# Altium project SuperCap UPS Rasp Pi.PrjPcb
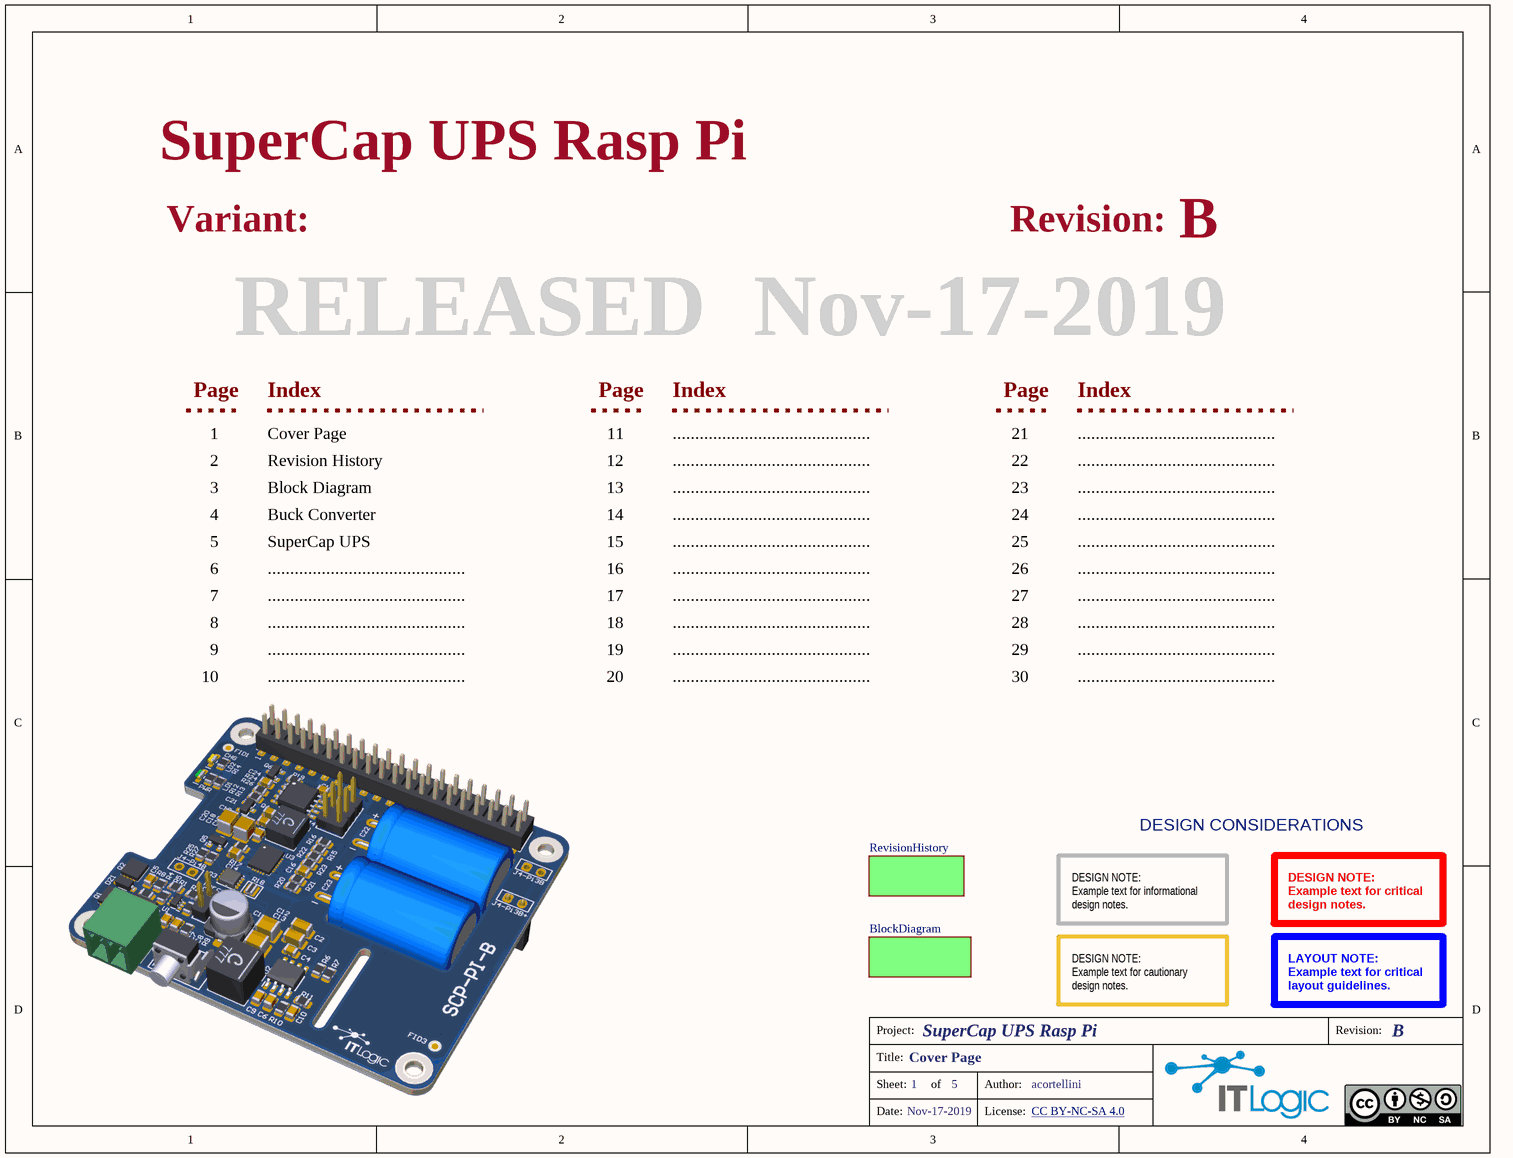
[diagram p0: Cover Page.SchDoc]
VersionRevision: B; ReleaseDate: Nov-17-2019; ProjectTitle: SuperCap UPS Rasp Pi; ProjectCode: SCP-PI-B; ProjectAuthor: acortellini
5 sheets, 79 parts. Net scope: flat (ports and power ports of the same name join across sheets).
Board files: SCAP-PI.PcbDoc, SCAP-PI-2L.PcbDoc, PANEL.PcbDoc
Sheets:
  Cover Page.SchDoc
    RevisionHistory = Revision History.SchDoc
    BlockDiagram = Block Diagram.SchDoc
      Buck Converter & Hat Connector = Buck Converter.SchDoc
      SuperCap UPS = SuperCap UPS.SchDoc

## Sheet Cover Page.SchDoc: Cover Page
size Letter; Organization: IT Logic; Address1: 5753 Highway 85 N; Address2: Crestview, FL 32536; Address3: United States; DocumentNumber: 1; SheetNumber: 1; SheetTotal: 5; Email: pcb-design@itlogic.cloud

### Sub-sheets
BlockDiagram = Block Diagram.SchDoc: no entries
RevisionHistory = Revision History.SchDoc: no entries

### Notes on the sheet
- Variant:
- Revision:
- RELEASED
- Page
- Index
- 1
- 2
- 3
- Cover Page
- Revision History
- Block Diagram
- 11
- 12
- 13
- ............................................
- 21
- 22
- 23
- 4
- 5
- Buck Converter
- SuperCap UPS
- 14
- 15
- 24
- 25
- 6
- 7
- 8
- 16
- 17
- 18
- 26
- 27
- 28
- 9
- 10
- 19
- 20
- 29
- 30
- DESIGN CONSIDERATIONS
- DESIGN NOTE:
  Example text for informational
  design notes.
- DESIGN NOTE:
  Example text for critical
  design notes.
- DESIGN NOTE:
  Example text for cautionary
  design notes.
- LAYOUT NOTE:
  Example text for critical
  layout guidelines.
- Project:
- Title:
- Sheet:
- of
- Author:
- Date:
- License:
- CC BY-NC-SA 4.0 <https://creativecommons.org/licenses/by-nc-sa/4.0/>

## Sheet Revision History.SchDoc: Revision History
size Letter; Author: Alfredo Cortellini; Organization: IT Logic; Address1: 5753 Highway 85 N; Address2: Crestview, FL 32536; Address3: United States; DocumentNumber: 2; SheetNumber: 2; SheetTotal: 5; Email: pcb-design@itlogic.cloud
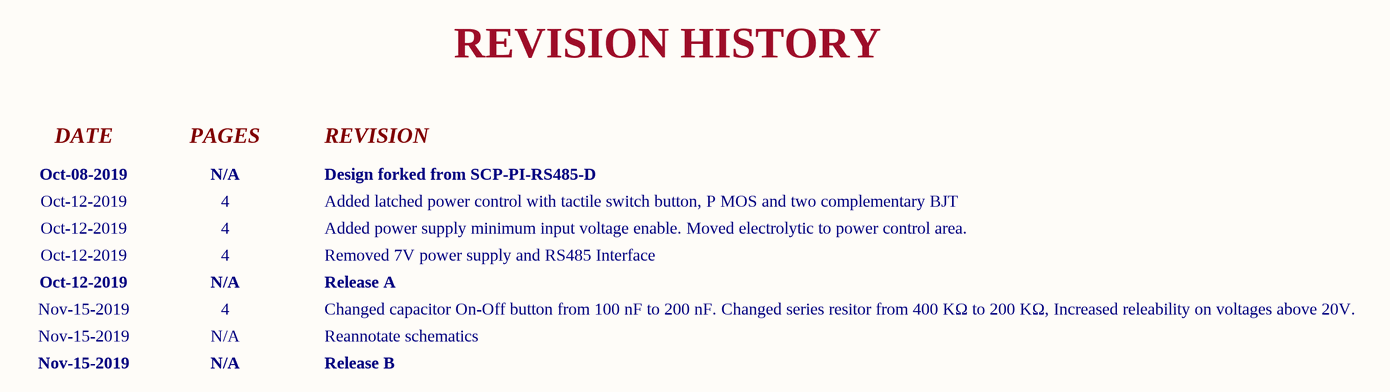
[diagram p1: Revision History.SchDoc]

### Notes on the sheet
- REVISION HISTORY
- DATE
- PAGES
- REVISION
- Oct-08-2019
- Oct-12-2019
- N/A
- 4
- Added latched power control with tactile switch button, P MOS and two complementary BJT
- Design forked from SCP-PI-RS485-D
- Removed 7V power supply and RS485 Interface
- Release A
- Added power supply minimum input voltage enable. Moved electrolytic to power control area.
- Nov-15-2019
- Reannotate schematics
- Changed capacitor On-Off button from 100 nF to 200 nF. Changed series resitor from 400 KΩ to 200 KΩ, Increased releability on voltages above 20V.
- Release B
- Project:
- Revision:
- Title:
- Sheet:
- of
- Author:
- Date:
- License:
- CC BY-NC-SA 4.0 <https://creativecommons.org/licenses/by-nc-sa/4.0/>

## Sheet Block Diagram.SchDoc: Block Diagram
size Letter; Author: Alfredo Cortellini; Organization: IT Logic; Address1: 5753 Highway 85 N; Address2: Crestview, FL 32536; Address3: United States; DocumentNumber: 3; SheetNumber: 3; SheetTotal: 5; Email: pcb-design@itlogic.cloud
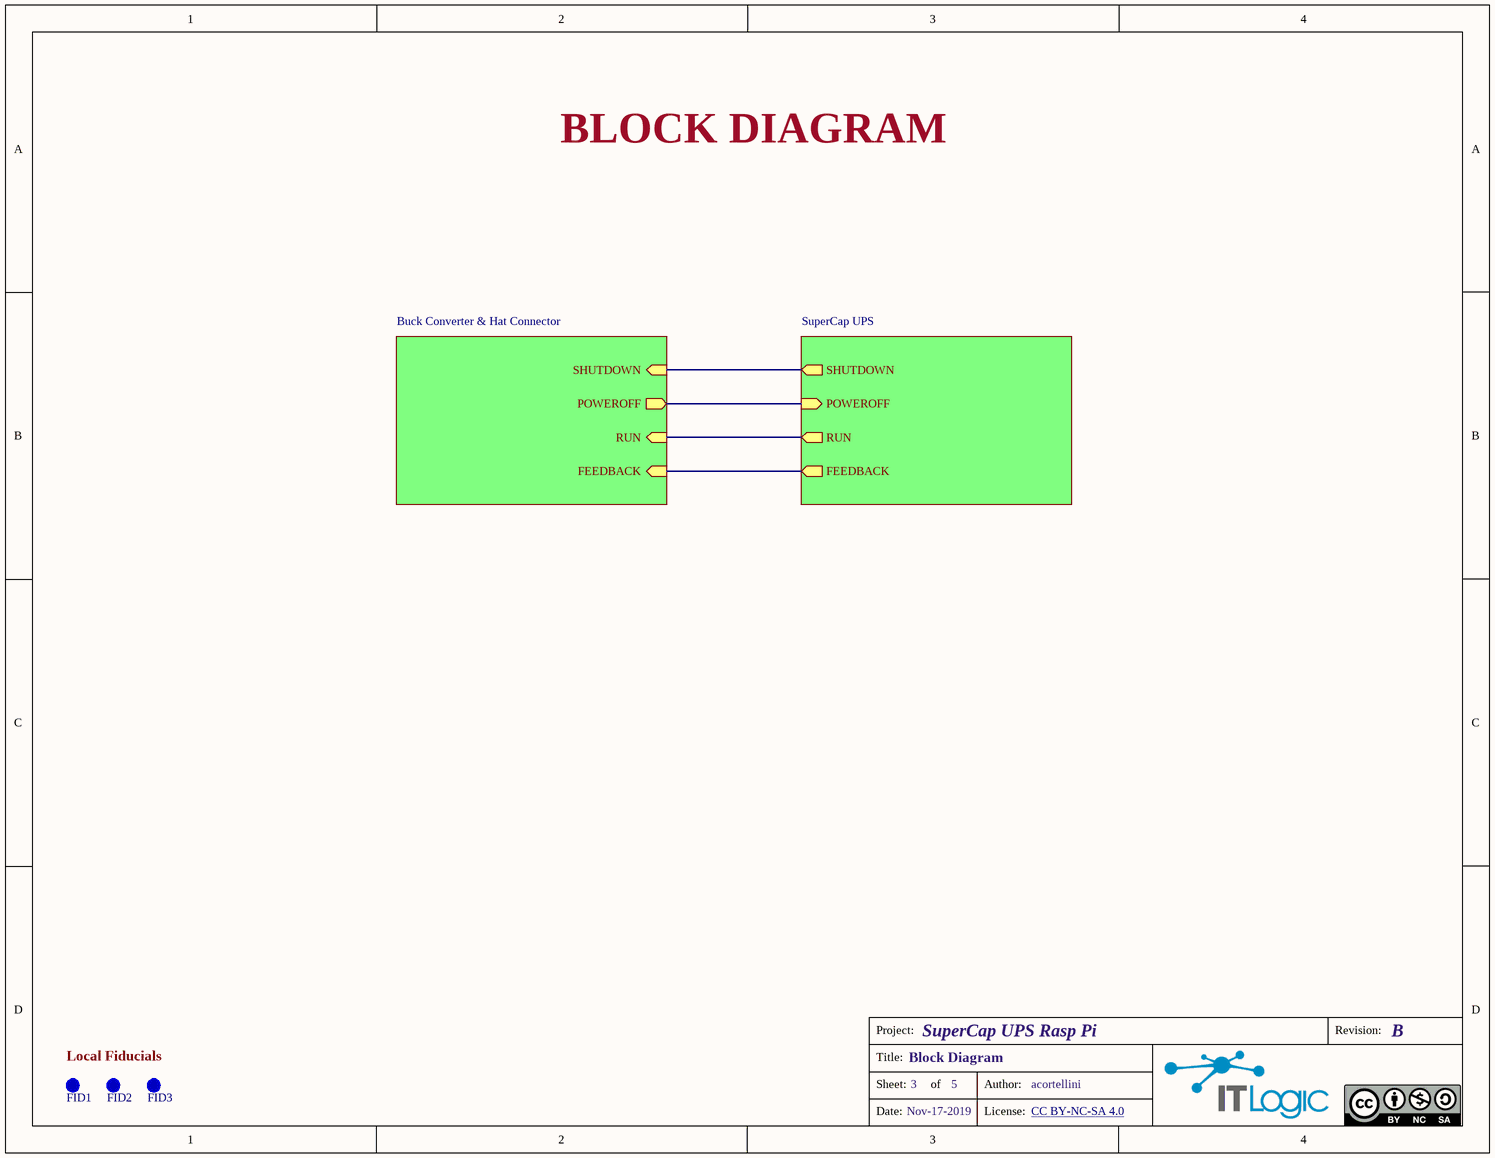
[diagram p2: Block Diagram.SchDoc]

### Parts
FID1  Local Fiducial  [FID-1-2MM]  (value not drawn)
FID2  Local Fiducial  [FID-1-2MM]  (value not drawn)
FID3  Local Fiducial  [FID-1-2MM]  (value not drawn)

### Sub-sheets
Buck Converter & Hat Connector = Buck Converter.SchDoc: POWEROFF (out), SHUTDOWN (in), RUN (in), FEEDBACK (in)
SuperCap UPS = SuperCap UPS.SchDoc: SHUTDOWN (out), POWEROFF (in), RUN (out), FEEDBACK (out)

### Nets
(unnamed): sheet Buck Converter & Hat Connector/POWEROFF, sheet SuperCap UPS/POWEROFF
(unnamed): sheet Buck Converter & Hat Connector/SHUTDOWN, sheet SuperCap UPS/SHUTDOWN
(unnamed): sheet Buck Converter & Hat Connector/RUN, sheet SuperCap UPS/RUN
(unnamed): sheet Buck Converter & Hat Connector/FEEDBACK, sheet SuperCap UPS/FEEDBACK

### Notes on the sheet
- BLOCK DIAGRAM
- Local Fiducials
- Project:
- Revision:
- Title:
- Sheet:
- of
- Author:
- Date:
- License:
- CC BY-NC-SA 4.0 <https://creativecommons.org/licenses/by-nc-sa/4.0/>

### Library data of the parts
FID1-FID3 = FID-1-2MM: Fiducial 1.0mm Diameter, 2.0mmil Mask

## Sheet Buck Converter.SchDoc: Buck Converter
size Letter; Author: Alfredo Cortellini; Organization: IT Logic; Address1: 5753 Highway 85 N; Address2: Crestview, FL 32536; Address3: United States; DocumentNumber: 4; SheetNumber: 4; SheetTotal: 5; Email: pcb-design@itlogic.cloud
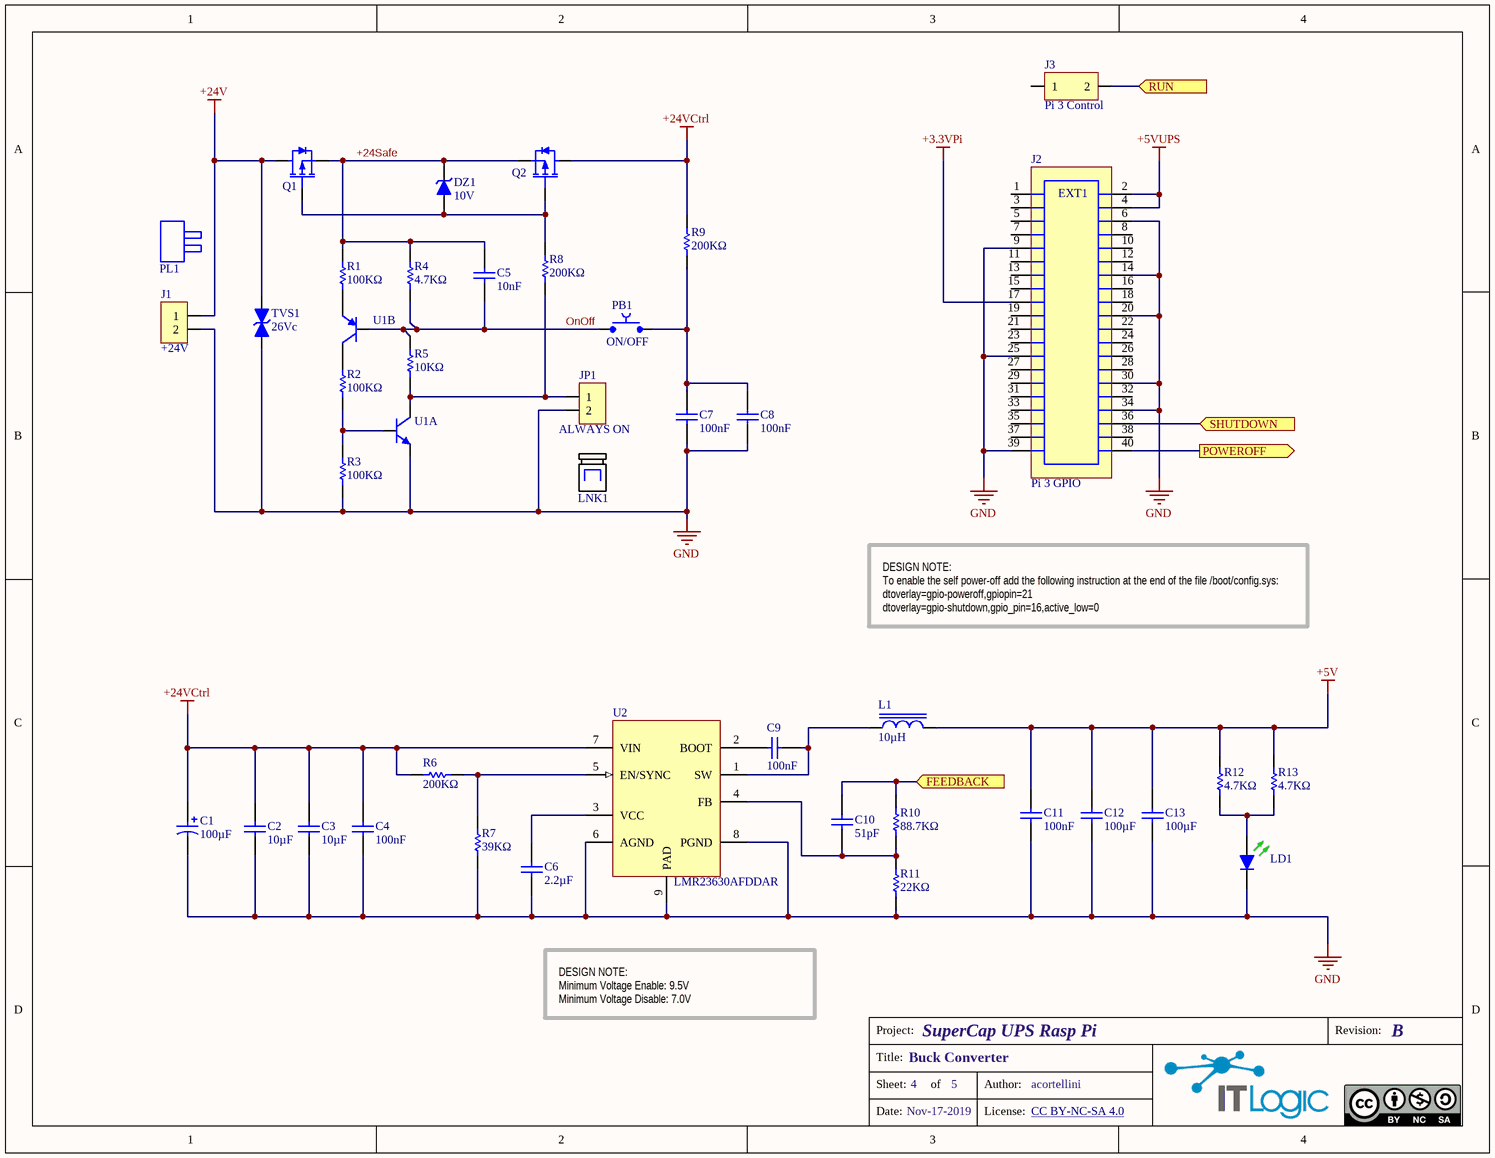
[diagram p3: Buck Converter.SchDoc]

### Parts
C1  100µF  [C-AE-C6-H60]
C2  10µF  [C1206-H180]
C3  10µF  [C1206-H180]
C4  100nF  [C0805-H10]
C5  10nF  [C0805-H10]
C6  2.2µF  [C0805-H140]
C7  100nF  [C0805-H10]
C8  100nF  [C0805-H10]
C9  100nF  [C0805-H10]
C10  51pF  [C0805-H10]
C11  100nF  [C0805-H10]
C12  100µF  [C1210-H250]
C13  100µF  [C1210-H250]
DZ1  10V  [SOD-123]
EXT1  SSQ-120-03-T-D-MEC  [SSQ-120-03-D-BOTTOM]  (value not drawn)
J1  +24V  [691322110002]
J2  Pi 3 GPIO  [HLE-120-02-F-DV-BE]
J3  Pi 3 Control  [SSQ-102-01-S-BOTTOM]
JP1  ALWAYS ON  [HDR-V-1R-02P-5.8L]
L1  10µH  [IND-XAL6060]
LD1  LTST-S220KGKT  [LED-0805-G-SIDE]  (value not drawn)
LNK1  2-881545-2  (value not drawn)  (mechanical)
PB1  ON/OFF  [BUT-1-1825027-4]
PL1  691361100002  (value not drawn)  (mechanical)
Q1  DMP6023LFG  [PowerDI3333-8-S]  (value not drawn)
Q2  DMP6023LFG  [PowerDI3333-8-S]  (value not drawn)
R1  100KΩ  [R0805-H60]
R2  100KΩ  [R0805-H60]
R3  100KΩ  [R0805-H60]
R4  4.7KΩ  [R0805-H60]
R5  10KΩ  [R0805-H60]
R6  200KΩ  [R0805-H60]
R7  39KΩ  [R0805-H60]
R8  200KΩ  [R0805-H60]
R9  200KΩ  [R0805-H60]
R10  88.7KΩ  [R0805-H60]
R11  22KΩ  [R0805-H60]
R12  4.7KΩ  [R0805-H60]
R13  4.7KΩ  [R0805-H60]
TVS1  26Vc  [DO-214AC-SMA-NO POL]
U1  MBT3946DW1T1G  [SOT-363]  (value not drawn)  (parts A,B of 2)
U2  LMR23630AFDDAR  [SOIC-8-N-HT]

### Ports
FEEDBACK (in), POWEROFF (out), RUN (in), SHUTDOWN (in)

### Nets
+3.3VPi: J2.17
+5V: C11.2 C12.2 C13.2 L1.2 R12.2 R13.2
+5VUPS: J2.2 J2.4
+24V: J1.1 Q1.3(D) TVS1.2
+24VCtrl: C1.1 C2.2 C3.2 C4.2 Q2.3(D) R6.2 R9.2 U2.7(VIN)
GND: C1.2 C2.1 C3.1 C4.1 C6.1 C7.1 C8.1 C11.1 C12.1 C13.1 J1.2 J2.6 J2.9 J2.14 J2.20 J2.25 J2.30 J2.34 J2.39 JP1.2 LD1.1(K) R3.1 R7.1 R11.1 TVS1.1 U1.1(E) U2.6(AGND) U2.8(PGND) U2.9(PAD)
+24Safe: C5.2 DZ1.1(K) Q1.1(S) Q2.1(S) R1.1 R4.2
MISO: J2.36 ; port SHUTDOWN
MOSI: J2.40 ; port POWEROFF
OnOff: C5.1 PB1.1 R4.1 R5.1 U1.5(B)
SCK: J3.2 ; port RUN
NetC6_2: C6.2 U2.3(VCC)
NetC7_2: C7.2 C8.2 PB1.2 R9.1
NetC9_1: C9.1 U2.2(BOOT)
NetC9_2: C9.2 L1.1 U2.1(SW)
NetC10_1: C10.1 R10.1 R11.2 U2.4(FB)
NetC10_2: C10.2 R10.2 ; port FEEDBACK
NetDZ1_2: DZ1.2(A) Q1.2(G) Q2.2(G) R8.2
NetJP1_1: JP1.1 R5.2 R8.1 U1.6(C)
NetLD1_2: LD1.2(A) R12.1 R13.1
NetR1_2: R1.2 U1.4(E)
NetR2_1: R2.1 R3.2 U1.2(B)
NetR2_2: R2.2 U1.3(C)
NetR6_1: R6.1 R7.2 U2.5(EN/SYNC)

Not connected (* = marked no-connect by the designer): J2 1 3 5 7 8 10 11 12 13 15 16 18 19 21 22 23 24 26 27 28 29 31 32 33 35 37 38; J3 1

### Notes on the sheet
- DESIGN NOTE:
  To enable the self power-off add the following instruction at the end of the file /boot/config.sys:
  dtoverlay=gpio-poweroff,gpiopin=21
  dtoverlay=gpio-shutdown,gpio_pin=16,active_low=0
- DESIGN NOTE:
  Minimum Voltage Enable: 9.5V
  Minimum Voltage Disable: 7.0V
- Project:
- Revision:
- Title:
- Sheet:
- of
- Author:
- Date:
- License:
- CC BY-NC-SA 4.0 <https://creativecommons.org/licenses/by-nc-sa/4.0/>

### Library data of the parts
C1 = EEE-FT1V101AP: Cap Electrolytic Alu 100uF 300V 20% (5.8 X 6.1mm) SMD 600mA 2000h 105C; Manufacturer: Panasonic; Voltage Rating: 35V; Resistance: 0.26R; Value: 100u; Manufacturer Part Number: EEE-FT1V101AP; Mount: Surface Mount; Capacitance: 100uF; ComponentLink1URL: https://industrial.panasonic.com/cdbs/www-data/pdf/RDE0000/ABA0000C1240.pdf; ComponentLink1Description: Data Sheet; Case: D8
C2 C3 = GRT31CR61H106ME01L: Cap 1206 Case Ceramic 10uF 50V X5S 20%; Manufacturer: Murata; Dielectric: X5R; Value: 10u; Manufacturer Part Number: GRT31CR61H106ME01L; Mount: Surface Mount; Case: 1206; Capacitance: 10uF; Voltage Rating: 50V; ComponentLink1URL: https://www.mouser.com/datasheet/2/400/lcc_commercial_general_en-837201.pdf; ComponentLink1Description: Data Sheet
C4 C7-C9 C11 = C0805C104K5RACTU: Cap 0805 Case Ceramic 100nF 50V X7R; Manufacturer: KEMET; Value: 100n; Manufacturer Part Number: C0805C104K5RACTU; Mount: Surface Mount; Case: 0805; Capacitance: 100nF; Dielectric: X7R; Voltage Rating: 50V; ComponentLink1URL: https://datasheet.ciiva.com/14589/70095383-14589048.pdf; ComponentLink1Description: Data Sheet
C5 = C0805C103K5RACTU: Cap 0805 Case Ceramic 10nF 50V X7R; Manufacturer: KEMET; Value: 10n; Manufacturer Part Number: C0805C103K5RACTU; Mount: Surface Mount; Case: 0805; Dielectric: X7R; Capacitance: 10nF; Voltage Rating: 50V; ComponentLink1URL: https://datasheet.ciiva.com/5904/kem-c1002-x7r-smd-5904709.pdf; ComponentLink1Description: Data Sheet
C6 = C0805C225K4RACTU: Cap 0805 Case Ceramic 2.2uF 16V X7R 10%; Manufacturer: KEMET; Capacitance: 22uF; Value: 2.2u; Manufacturer Part Number: C0805C225K4RACTU; Mount: Surface Mount; Case: 0805; Dielectric: X7R; Voltage Rating: 16V; ComponentLink1URL: http://components.arrow.com/part/dataview/0323_07281823; ComponentLink1Description: Data Sheet
C10 = C0805C510K5GACTU: Cap 0805 Case Ceramic 51pF 50V C0G 10%; Manufacturer: KEMET; Value: 51p; Manufacturer Part Number: C0805C510K5GACTU; Mount: Surface Mount; Case: 0805; Capacitance: 51pF; Dielectric: C0G; Voltage Rating: 50V; ComponentLink1URL: https://www.mouser.com/datasheet/2/212/KEM_C1003_C0G_SMD-1101588.pdf; ComponentLink1Description: Data Sheet
C12 C13 = GRM32ER61A107ME20L: Cap 1210 Case Ceramic 100uF 10V X5S 20%; Manufacturer: Murata; Dielectric: X5R; Value: 100u; Manufacturer Part Number: GRM32ER61A107ME20L; Mount: Surface Mount; Case: 1210; Capacitance: 100uF; Voltage Rating: 10V; ComponentLink1URL: https://www.mouser.com/datasheet/2/400/lcc_commercial_general_en-837201.pdf; ComponentLink1Description: Data Sheet
DZ1 = BZT52C10-E3-08: Diode Zener Single 10V 5% 400mW SOD-123; Manufacturer: Vishay Semiconductors; Manufacturer Part Number: BZT52C10-E3-08; Mount: Surface Mount; Case: SOD-123; Voltage Rating: 10V; ComponentLink1Description: Data Sheet; ComponentLink1URL: https://www.vishay.com/docs/85760/bzt52.pdf
EXT1 = SSQ-120-03-T-D-MEC: Conn Post Socket Header Vert - 2 Row - 20 Pos - 10 mm Lenght - Tin; Manufacturer: Samtec; Current Rating: 3A; Manufacturer Part Number: SSQ-120-03-T-D; Mount: Free Hanging; ComponentLink1URL: https://datasheet.ciiva.com/717/eng-cd-146256-g-146256-c-dwg-717712.pdf; ComponentLink1Description: Data Sheet
J1 = 691322110002: Conn Term Block Header 2 Pos 3.5 mm; Manufacturer: Wurth Electronics; Current Rating: 10A; Voltage Rating: 300V; Manufacturer Part Number: 691322110002; Mount: Through Hole; ComponentLink1URL: https://datasheet.ciiva.com/8043/1442234-8043560.pdf; ComponentLink1Description: Data Sheet
J2 = HLE-120-02-F-DV-BE: Conn Socket Header Vert - 2 Row - 20 Pos - SMD; Manufacturer: Samtec; Current Rating: 3A; Manufacturer Part Number: HLE-120-02-F-DV-BE; Mount: Surface Mount; ComponentLink1URL: https://datasheet.ciiva.com/717/eng-cd-146256-g-146256-c-dwg-717712.pdf; ComponentLink1Description: Data Sheet
J3 = SSQ-102-01-T-S: Conn Post Socket Header Vert - 1 Row - 2 Pos - 3 mm Lenght - Tin; Manufacturer: Samtec; Current Rating: 3A; Manufacturer Part Number: SSQ-102-01-T-S; Mount: Through Hole; ComponentLink1URL: https://datasheet.ciiva.com/717/eng-cd-146256-g-146256-c-dwg-717712.pdf; ComponentLink1Description: Data Sheet
JP1 = 22-28-4023: Breakaway Header Vert - 1 Row - 2 Pos - 6 mm Lenght - Gold; Manufacturer: Molex; Voltage Rating: 250V; Current Rating: 4A; Manufacturer Part Number: 22-28-4023; Mount: Through Hole; ComponentLink1URL: https://datasheet.ciiva.com/10088/0022284023-pcb-headers-10088337.pdf; ComponentLink1Description: Data Sheet
L1 = XAL6060-103MEB: Inductor Power XAL60 Series, 10uH, 7.6A,  Shielded, 27 mOhm, SMD; Manufacturer: Coilcraft; Value: 10u; Manufacturer Part Number: XAL6060-103MEB; Inductance: 10µH; ComponentLink1URL: https://www.coilcraft.com/xal50xx.cfm; ComponentLink1Description: Data Sheet; Mount: Surface Mount
LD1 = LTST-S220KGKT: LED 0805 Side Green 569nm 2-Pin; Manufacturer: Vishay Lite-On; Manufacturer Part Number: LTST-S220KGKT; Mount: Surface Mount; Case: 0805; ComponentLink1URL: https://www.tme.eu/Document/34ab2c4b8c99e859d5012ee3f8356040/LTST-S220GKT.pdf; ComponentLink1Description: Data Sheet
LNK1 = 2-881545-2: Jumper Red, 2 Pos, 2.54 pitch; Manufacturer: TE Connectivity; Manufacturer Part Number: 2-881545-2; ComponentLink1URL: https://datasheet.ciiva.com/3120/c-881545-k-3120181.pdf; ComponentLink1Description: Data Sheet; Mount: Free Hanging
PB1 = 1-1825027-4: Tactile Switch, Round Stem, Color ivory, Lenght 3.55mm, Right Angle, Through Hole.; Manufacturer: TE Connectivity; Voltage Rating: 24V; Current Rating: 50 mA; Manufacturer Part Number: 1-1825027-4; Mount: Through Hole; ComponentLink1URL: https://www.mouser.com/datasheet/2/418/NG_CD_1825027_G4-659945.pdf; ComponentLink1Description: Data Sheet
PL1 = 691361100002: Conn Term Block Plug Vert 2 Pos 3.5 mm; Manufacturer: Wurth Electronics; Current Rating: 10A; Voltage Rating: 300V; Manufacturer Part Number: 691361100002; Mount: Free Hanging; ComponentLink1URL: https://datasheet.ciiva.com/7992/1442235-7992395.pdf; ComponentLink1Description: Data Sheet
Q1 Q2 = DMP6023LFG: Mosfet P 60V Vds 20V Vgs 25mOhm PowerDI3333-8; Manufacturer: Diodes Incorporated; Manufacturer Part Number: DMP6023LFG; Mount: Surface Mount; Case: PowerDI3333-8; ComponentLink1Description: Data Sheet; ComponentLink1URL: https://www.diodes.com/assets/Datasheets/DMP6023LFG.pdf
R1-R3 = RC0805FR-07100KL: Resistor 0805 Case 100KR 1% 1/8W; Manufacturer: Yageo; Voltage Rating: 150V; Value: 100K; Manufacturer Part Number: RC0805FR-07100KL; Case: 0805; Resistance: 100kR; ComponentLink1URL: https://datasheet.ciiva.com/2457/pyu-r-int-thick-7-2457017.pdf; ComponentLink1Description: Data Sheet; Mount: Surface Mount
R4 R12 R13 = RC0805FR-074K7L: Resistor 0805 Case 4.7KR 1% 1/8W; Manufacturer: Yageo; Voltage Rating: 150V; Value: 4.7K; Manufacturer Part Number: RC0805FR-074K7L; Case: 0805; Resistance: 4.7kR; ComponentLink1URL: https://datasheet.ciiva.com/11808/0900766b8106beab-11808155.pdf; ComponentLink1Description: Data Sheet; Mount: Surface Mount
R5 = RC0805FR-0710KL: Resistor 0805 Case 10KR 1% 1/8W; Manufacturer: Yageo; Voltage Rating: 150V; Value: 10K; Manufacturer Part Number: RC0805FR-0710KL; Case: 0805; Resistance: 10kR; ComponentLink1URL: https://datasheet.ciiva.com/11808/0900766b8106beab-11808151.pdf; ComponentLink1Description: Data Sheet; Mount: Surface Mount
R6 R8 R9 = RC0805FR-07200KL: Resistor 0805 Case 200KR 1% 1/8W; Manufacturer: Yageo; Voltage Rating: 150V; Value: 200K; Manufacturer Part Number: RC0805FR-07200KL; Case: 0805; Resistance: 200kR; ComponentLink1URL: https://datasheet.ciiva.com/2457/pyu-r-int-thick-7-2457017.pdf; ComponentLink1Description: Data Sheet; Mount: Surface Mount
R7 = RC0805FR-0739KL: Resistor 0805 Case 39KR 1% 1/8W; Manufacturer: Yageo; Voltage Rating: 150V; Value: 39K; Manufacturer Part Number: RC0805FR-0739KL; Case: 0805; Resistance: 39KR; ComponentLink1URL: https://datasheet.ciiva.com/11808/0900766b8106beab-11808155.pdf; ComponentLink1Description: Data Sheet; Mount: Surface Mount
R10 = RC0805FR-0788K7L: Resistor 0805 Case 88.7KR 1% 1/8W; Manufacturer: Yageo; Voltage Rating: 150V; Value: 88.7K; Manufacturer Part Number: RC0805FR-0788K7L; Case: 0805; Resistance: 88.7kR; ComponentLink1URL: https://datasheet.ciiva.com/2457/pyu-r-int-thick-7-2457521.pdf; ComponentLink1Description: Data Sheet; Mount: Surface Mount
R11 = RC0805FR-0722KL: Resistor 0805 Case 22KR 1% 1/8W; Manufacturer: Yageo; Voltage Rating: 150V; Value: 22K; Manufacturer Part Number: RC0805FR-0722KL; Case: 0805; Resistance: 22kR; ComponentLink1URL: https://datasheet.ciiva.com/2457/pyu-r-int-thick-7-2457521.pdf; ComponentLink1Description: Data Sheet; Mount: Surface Mount
TVS1 = SMAJ26CA: TVS Diode Bidirectional 26Vs, 42.1Vc, 9.5 Amp, SMA; Manufacturer: Littelfuse; Manufacturer Part Number: SMAJ26CA; Mount: Surface Mount; ComponentLink1URL: https://datasheet.ciiva.com/332/littelfuse-tvs-diode-smdj-datasheet-pdf-332997.pdf; ComponentLink1Description: Data Sheet; Case: SMA
U1 = MBT3946DW1T1G: Transistor Complementary Dual 40V  200mA SOT−363; Manufacturer: ON Semiconductor; Manufacturer Part Number: MBT3946DW1T1G; Mount: Surface Mount; Case: SDIP-6; ComponentLink1URL: https://datasheet.ciiva.com/1249/683405-1249888.pdf; ComponentLink1Description: Data Sheet
U2 = LMR23630AFDDAR: Conv DC-DC Sync Step-Down 36V 3A 9-Pin(8+Pab) HSOIC-8; Manufacturer: Texas Instruments; Manufacturer Part Number: LMR23630AFDDAR; Mount: Surface Mount; Case: HSOIC-8; ComponentLink1URL: http://www.ti.com/lit/ds/symlink/lmr23630.pdf; ComponentLink1Description: Data Sheet

## Sheet SuperCap UPS.SchDoc: SuperCap UPS
size Letter; Author: Alfredo Cortellini; Organization: IT Logic; Address1: 5753 Highway 85 N; Address2: Crestview, FL 32536; Address3: United States; DocumentNumber: 5; SheetNumber: 5; SheetTotal: 5; Email: pcb-design@itlogic.cloud
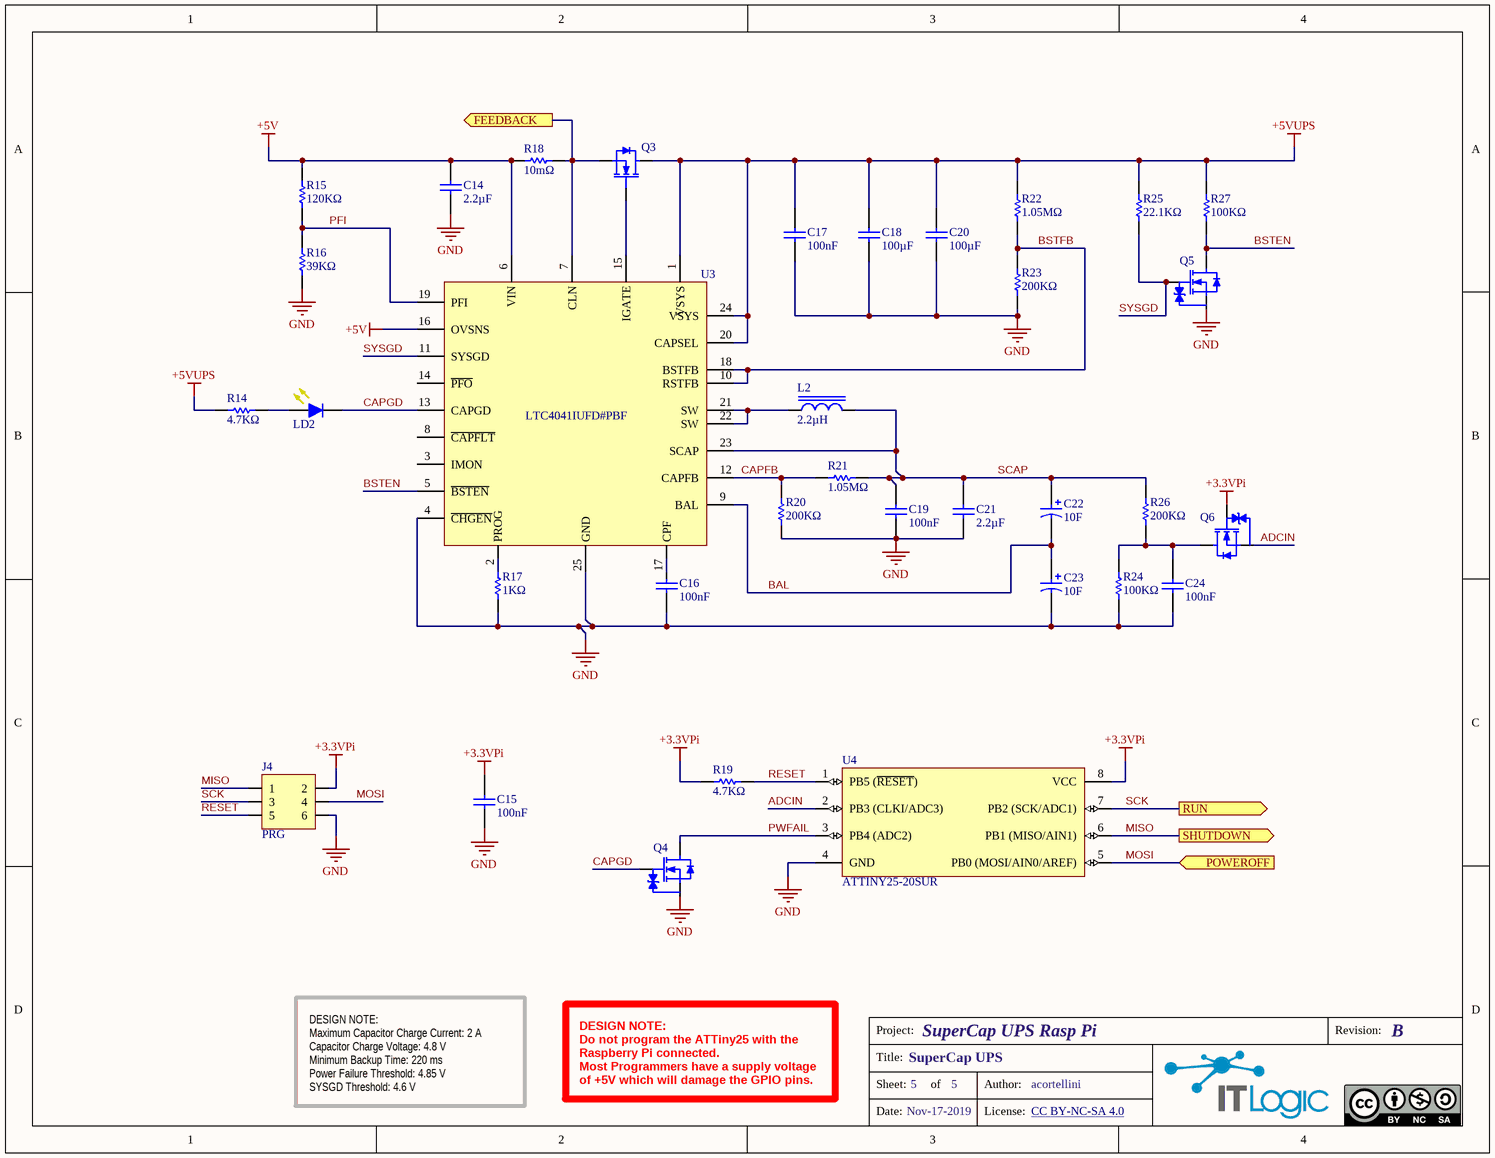
[diagram p4: SuperCap UPS.SchDoc]

### Parts
C14  2.2µF  [C0805-H140]
C15  100nF  [C0805-H10]
C16  100nF  [C0805-H10]
C17  100nF  [C0805-H10]
C18  100µF  [C1210-H250]
C19  100nF  [C0805-H10]
C20  100µF  [C1210-H250]
C21  2.2µF  [C0805-H140]
C22  10F  [C-SCCT20B106PRB-ORIZ]
C23  10F  [C-SCCT20B106PRB-ORIZ]
C24  100nF  [C0805-H10]
J4  PRG  [HDR-V-2R-03P-5.8L]
L2  2.2µH  [IND-XAL5030]
LD2  LTST-S220KSKT  [LED-0805-Y-SIDE]  (value not drawn)
Q3  SISA88DN-T1-GE3  [POWERPAK-1212-8-S]  (value not drawn)
Q4  BSS138K-13  [SOT-23]  (value not drawn)
Q5  BSS138K-13  [SOT-23]  (value not drawn)
Q6  BSS138K-13  [SOT-23]  (value not drawn)
R14  4.7KΩ  [R0805-H60]
R15  120KΩ  [R0805-H60]
R16  39KΩ  [R0805-H60]
R17  1KΩ  [R0805-H60]
R18  10mΩ  [R0508-H60]
R19  4.7KΩ  [R0805-H60]
R20  200KΩ  [R0805-H60]
R21  1.05MΩ  [R0805-H60]
R22  1.05MΩ  [R0805-H60]
R23  200KΩ  [R0805-H60]
R24  100KΩ  [R0805-H60]
R25  22.1KΩ  [R0805-H60]
R26  200KΩ  [R0805-H60]
R27  100KΩ  [R0805-H60]
U3  LTC4041IUFD#PBF  [QFN-50x40-24-THP]
U4  ATTINY25-20SUR  [SOIC-8-W]

### Ports
FEEDBACK (out), POWEROFF (in), RUN (out), SHUTDOWN (out)

### Nets
+3.3VPi: C15.2 J4.2 Q6.1(G) R19.1 U4.8(VCC)
+5V: C14.2 R15.2 R18.1 U3.6(VIN) U3.16(OVSNS)
+5VUPS: C17.2 C18.2 C20.2 Q3.3(D) R14.1 R22.2 R25.2 R27.2 U3.1(VSYS) U3.20(CAPSEL) U3.24(VSYS)
GND: C14.1 C15.1 C16.1 C17.1 C18.1 C19.1 C20.1 C21.1 C23.2 C24.1 J4.6 Q4.2(S) Q5.2(S) R16.1 R17.1 R20.1 R23.1 R24.1 U3.4(~{CHGEN}) U3.25(GND) U4.4(GND)
ADCIN: Q6.2(S) U4.2(PB3_(CLKI/ADC3))
BAL: C22.2 C23.1 U3.9(BAL)
BSTEN: Q5.3(D) R27.1 U3.5(~{BSTEN})
BSTFB: R22.1 R23.2 U3.10(RSTFB) U3.18(BSTFB)
CAPFB: R20.2 R21.1 U3.12(CAPFB)
CAPGD: LD2.1(K) Q4.1(G) U3.13(CAPGD)
MISO: J4.1 U4.6(PB1_(MISO/AIN1)) ; port SHUTDOWN
MOSI: J4.4 U4.5(PB0_(MOSI/AIN0/AREF)) ; port POWEROFF
PFI: R15.1 R16.2 U3.19(PFI)
PWFAIL: Q4.3(D) U4.3(PB4_(ADC2))
RESET: J4.5 R19.2 U4.1(PB5_(~{RESET}))
SCAP: C19.2 C21.2 C22.1 L2.2 R21.2 R26.2 U3.23(SCAP)
SCK: J4.3 U4.7(PB2_(SCK/ADC1)) ; port RUN
SYSGD: Q5.1(G) R25.1 U3.11(SYSGD)
NetC10_2: Q3.1(S) R18.2 U3.7(CLN) ; port FEEDBACK
NetC16_2: C16.2 U3.17(CPF)
NetC24_2: C24.2 Q6.3(D) R24.2 R26.1
NetL2_1: L2.1 U3.21(SW) U3.22(SW)
NetLD2_2: LD2.2(A) R14.2
NetQ3_2: Q3.2(G) U3.15(IGATE)
NetR17_2: R17.2 U3.2(PROG)

Not connected (* = marked no-connect by the designer): U3 3(IMON) 8(~{CAPFLT}) 14(~{PFO})

### Notes on the sheet
- DESIGN NOTE:
  Maximum Capacitor Charge Current: 2 A
  Capacitor Charge Voltage: 4.8 V
  Minimum Backup Time: 220 ms
  Power Failure Threshold: 4.85 V
  SYSGD Threshold: 4.6 V
- DESIGN NOTE:
  Do not program the ATTiny25 with the Raspberry Pi connected.
  Most Programmers have a supply voltage of +5V which will damage the GPIO pins.
- Project:
- Revision:
- Title:
- Sheet:
- of
- Author:
- Date:
- License:
- CC BY-NC-SA 4.0 <https://creativecommons.org/licenses/by-nc-sa/4.0/>

### Library data of the parts
C14 C21 = C0805C225K4RACTU: as C6 on sheet Buck Converter; Manufacturer Part Number: C0805C225K4RACTU; Mount: Surface Mount; Case: 0805; Dielectric: X7R; Voltage Rating: 16V; ComponentLink1URL: http://components.arrow.com/part/dataview/0323_07281823; ComponentLink1Description: Data Sheet
C15-C17 C19 C24 = C0805C104K5RACTU: as C4 on sheet Buck Converter; Manufacturer Part Number: C0805C104K5RACTU; Mount: Surface Mount; Case: 0805; Capacitance: 100nF; Dielectric: X7R; Voltage Rating: 50V; ComponentLink1URL: https://datasheet.ciiva.com/14589/70095383-14589048.pdf; ComponentLink1Description: Data Sheet
C18 C20 = GRM32ER61A107ME20L: as C12 on sheet Buck Converter; Manufacturer Part Number: GRM32ER61A107ME20L; Mount: Surface Mount; Case: 1210; Capacitance: 100uF; Voltage Rating: 10V; ComponentLink1URL: https://www.mouser.com/datasheet/2/400/lcc_commercial_general_en-837201.pdf; ComponentLink1Description: Data Sheet
C22 C23 = SCCT20E106SRB: Cap Super 10F 3.0V (20 X 12.5mm) ESR 50mOhm; Manufacturer: AVX; Resistance: 0.05R; Value: 10; Manufacturer Part Number: SCCT20E106SRB; Mount: Through Hole; Capacitance: 10F; Voltage Rating: 3.0V; ComponentLink1URL: https://datasheet.ciiva.com/3773/41677623s8437994n1386-3773397.pdf; ComponentLink1Description: Data Sheet
J4 = 5-146256-3: Breakaway Header Vert - 2 Row - 3 Pos - 6 mm Lenght - Gold; Manufacturer: TE Connectivity; Current Rating: 3A; Manufacturer Part Number: 5-146256-3; Mount: Through Hole; ComponentLink1URL: https://datasheet.ciiva.com/16290/eng-cd-146256-f2-16290485.pdf; ComponentLink1Description: Data Sheet
L2 = XAL5030-222MEB: Inductor Power SRP6540 Series, 2.2uH, 9.7A,  Shielded, 0.0132 ohm, SMD; Manufacturer: Coilcraft; Value: 2.2u; Manufacturer Part Number: XAL5030-222MEB; Inductance: 2.2uH; ComponentLink1URL: https://www.coilcraft.com/xal50xx.cfm; ComponentLink1Description: Data Sheet; Mount: Surface Mount
LD2 = LTST-S220KSKT: LED 0805 Side Yellow 588nm 2-Pin; Manufacturer: Vishay Lite-On; Manufacturer Part Number: LTST-S220KSKT; Mount: Surface Mount; Case: 0805; ComponentLink1URL: https://www.mouser.com/datasheet/2/239/Lite-On-LTST-S220KSKT-1175446.pdf; ComponentLink1Description: Data Sheet
Q3 = SISA88DN-T1-GE3: Mosfet 30V Vds 20V Vgs 5.4mOhm PowerPAK 1212-8; Manufacturer: Vishay; Manufacturer Part Number: SISA88DN-T1-GE3; Mount: Surface Mount; Case: PowerPAK 1212-8; ComponentLink1Description: Data Sheet; ComponentLink1URL: https://www.vishay.com/docs/76062/sisa88dn.pdf
Q4-Q6 = BSS138K-13: Mosfet N 50V Vds 20V Vgs ESD 1.4R SOT-23; Manufacturer: Diodes; Manufacturer Part Number: BSS138K-13; Mount: Surface Mount; Case: SOT-23; ComponentLink1Description: Data Sheet; ComponentLink1URL: https://www.diodes.com/assets/Datasheets/BSS138K.pdf
R14 R19 = RC0805FR-074K7L: as R4 on sheet Buck Converter; Manufacturer Part Number: RC0805FR-074K7L; Case: 0805; Resistance: 4.7kR; ComponentLink1URL: https://datasheet.ciiva.com/11808/0900766b8106beab-11808155.pdf; ComponentLink1Description: Data Sheet; Mount: Surface Mount
R15 = RC0805FR-07120KL: Resistor 0805 Case 120KR 1% 1/8W; Manufacturer: Yageo; Voltage Rating: 150V; Value: 120K; Manufacturer Part Number: RC0805FR-07120KL; Case: 0805; Resistance: 120kR; ComponentLink1URL: https://datasheet.ciiva.com/2457/pyu-r-int-thick-7-2457752.pdf; ComponentLink1Description: Data Sheet; Mount: Surface Mount
R16 = RC0805FR-0739KL: as R7 on sheet Buck Converter; Manufacturer Part Number: RC0805FR-0739KL; Case: 0805; Resistance: 39KR; ComponentLink1URL: https://datasheet.ciiva.com/11808/0900766b8106beab-11808155.pdf; ComponentLink1Description: Data Sheet; Mount: Surface Mount
R17 = RC0805FR-071KL: Resistor 0805 Case 1KR 1% 1/8W; Manufacturer: Yageo; Voltage Rating: 150V; Value: 1K; Manufacturer Part Number: RC0805FR-071KL; Case: 0805; Resistance: 1kR; ComponentLink1URL: https://datasheet.ciiva.com/2456/pyu-r-int-thick-7-2456976.pdf; ComponentLink1Description: Data Sheet; Mount: Surface Mount
R18 = KRL2012E-M-R010-F-T5: Resistor 0508 Case 10mR 1% 1/2W Current Sense; Manufacturer: Susumu; Voltage Rating: 10V; Value: 10m; Manufacturer Part Number: KRL2012E-M-R010-F-T5; Case: 0508; Resistance: 10mR; ComponentLink1URL: https://datasheet.ciiva.com/2484/wsr-2484454.pdf; ComponentLink1Description: Data Sheet; Mount: Surface Mount
R20 R23 R26 = RC0805FR-07200KL: as R6 on sheet Buck Converter; Manufacturer Part Number: RC0805FR-07200KL; Case: 0805; Resistance: 200kR; ComponentLink1URL: https://datasheet.ciiva.com/2457/pyu-r-int-thick-7-2457017.pdf; ComponentLink1Description: Data Sheet; Mount: Surface Mount
R21 R22 = RC0805FR-071M05L: Resistor 0805 Case 1.05MR 1% 1/8W; Manufacturer: Yageo; Voltage Rating: 150V; Value: 1.05M; Manufacturer Part Number: RC0805FR-071M05L; Case: 0805; Resistance: 1.05MR; ComponentLink1URL: https://datasheet.ciiva.com/2457/pyu-r-int-thick-7-2457017.pdf; ComponentLink1Description: Data Sheet; Mount: Surface Mount
R24 R27 = RC0805FR-07100KL: as R1 on sheet Buck Converter; Manufacturer Part Number: RC0805FR-07100KL; Case: 0805; Resistance: 100kR; ComponentLink1URL: https://datasheet.ciiva.com/2457/pyu-r-int-thick-7-2457017.pdf; ComponentLink1Description: Data Sheet; Mount: Surface Mount
R25 = RC0805FR-0722K1L: Resistor 0805 Case 22.1KR 1% 1/8W; Manufacturer: Yageo; Voltage Rating: 150V; Value: 22.1K; Manufacturer Part Number: RC0805FR-0722K1L; Case: 0805; Resistance: 22.1kR; ComponentLink1URL: https://datasheet.ciiva.com/2457/pyu-r-int-thick-7-2457521.pdf; ComponentLink1Description: Data Sheet; Mount: Surface Mount
U3 = LTC4041IUFD#PBF: Power Management 2.5A Supercapacitor Backup Buck Converter and Charger; Manufacturer: Analog Devices; Manufacturer Part Number: LTC4041IUFD#PBF; Mount: Surface Mount; Case: QFN-24; ComponentLink1URL: http://www.ti.com/lit/ds/symlink/lmr23630.pdf; ComponentLink1Description: Data Sheet
U4 = ATTINY25-20SUR: AVR MCU8-bit ATTiny - 2kB Flash 0.128kB EEPROM 6 I/O Pins - SOIC-8-W; Manufacturer: Microchip; Frequency: 20MHz; Manufacturer Part Number: ATTINY25-20SUR; Mount: Surface Mount; Case: SOIC-8-W; ComponentLink1URL: http://ww1.microchip.com/downloads/en/DeviceDoc/PIC16-L-F15313_23-Data-Sheet-40001897B.pdf; ComponentLink1Description: Data Sheet

## Nets that join several sheets
+3.3VPi: Buck Converter (J2.17), SuperCap UPS (5 pins)
+5V: Buck Converter (6 pins), SuperCap UPS (5 pins)
+5VUPS: Buck Converter (J2.2 J2.4), SuperCap UPS (11 pins)
GND: Buck Converter (29 pins), SuperCap UPS (21 pins)
MISO: Buck Converter (J2.36), SuperCap UPS (J4.1 U4.6)
MOSI: Buck Converter (J2.40), SuperCap UPS (J4.4 U4.5)
NetC10_2: Buck Converter (C10.2 R10.2), SuperCap UPS (Q3.1 R18.2 U3.7)
SCK: Buck Converter (J3.2), SuperCap UPS (J4.3 U4.7)